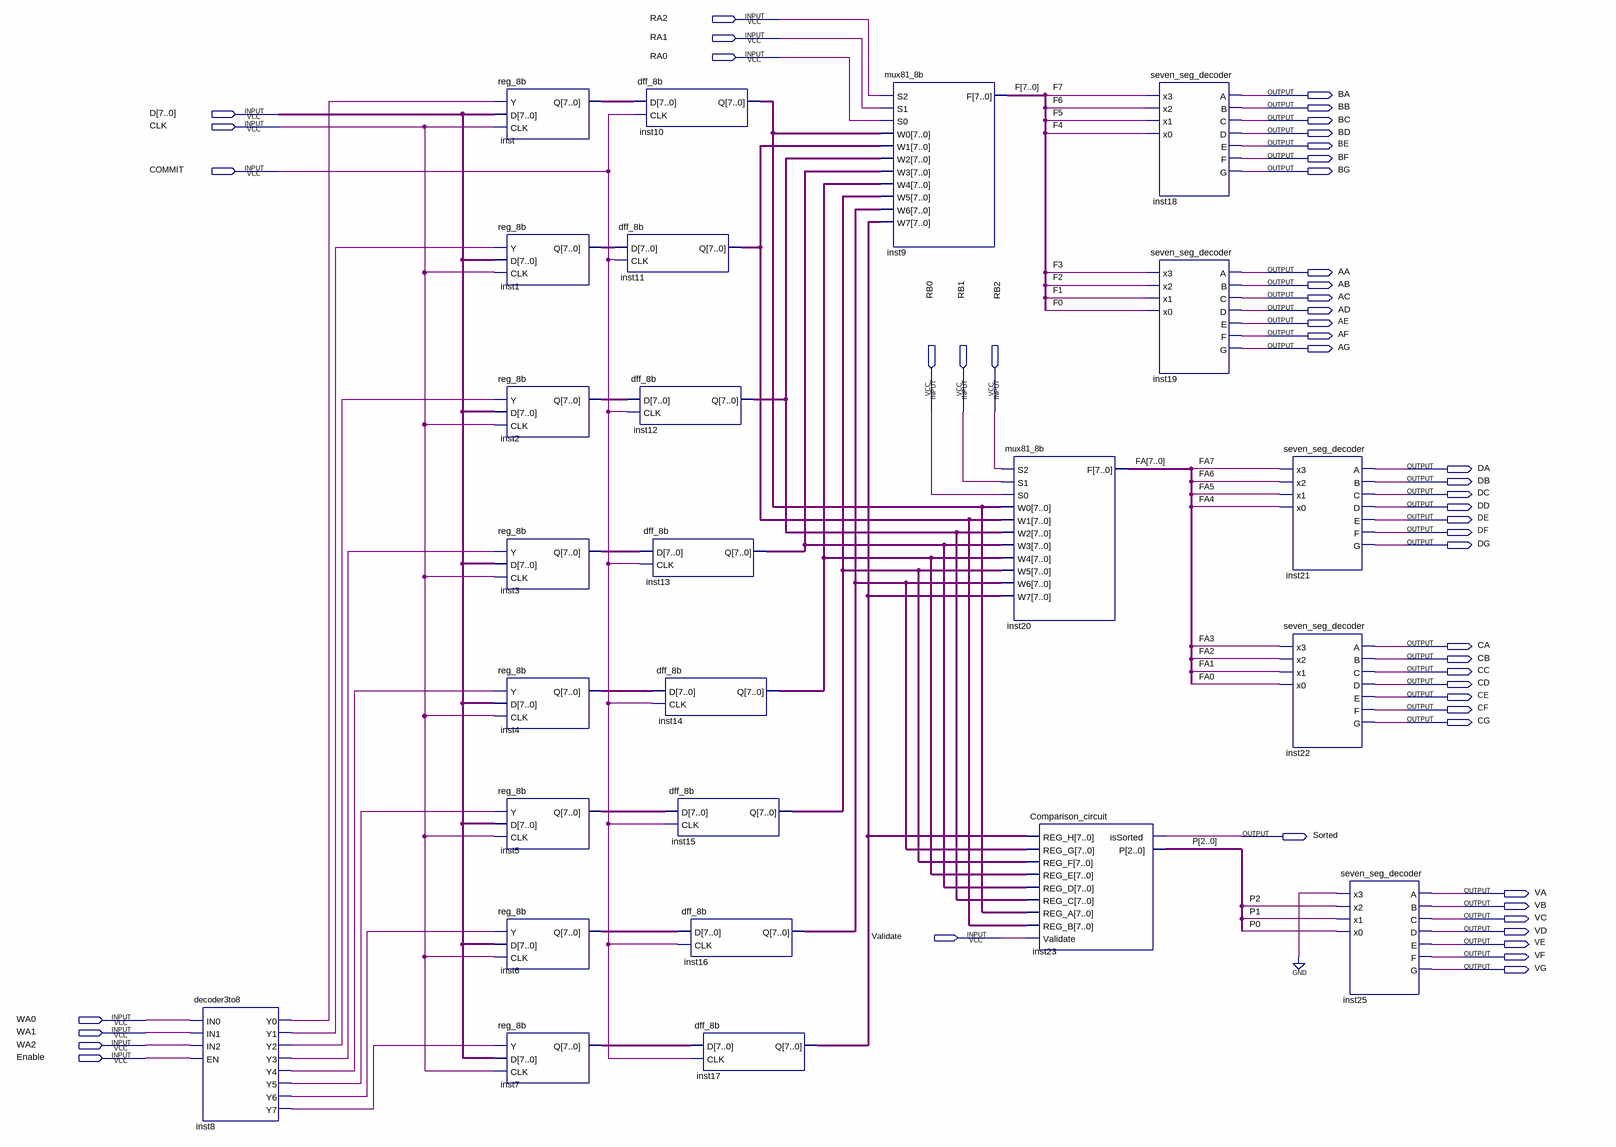
[diagram p0: schematic sheet]
// Quartus schematic Checker.bdf as structural Verilog: 25 symbols, 50 pins
module Checker (
  input  RA2,
  input  RA1,
  input  RA0,
  input  [7:0] D,
  input  CLK,
  input  COMMIT,
  input  RB0,
  input  RB1,
  input  RB2,
  input  Validate,
  input  WA0,
  input  WA1,
  input  WA2,
  input  Enable,
  output BA,
  output BB,
  output BC,
  output BD,
  output BE,
  output BF,
  output BG,
  output AA,
  output AB,
  output AC,
  output AD,
  output AE,
  output AF,
  output AG,
  output DA,
  output DB,
  output DC,
  output DD,
  output DE,
  output DF,
  output DG,
  output CA,
  output CB,
  output CC,
  output CD,
  output CE,
  output CF,
  output CG,
  output Sorted,
  output VA,
  output VB,
  output VC,
  output VD,
  output VE,
  output VF,
  output VG
);

  wire inst8_y0, inst8_y1, inst8_y2, inst8_y3, inst8_y4, inst8_y5, inst8_y6, inst8_y7;
  wire [2:0] P;
  wire [7:0] F, FA, inst1_q, inst2_q, inst3_q, inst4_q, inst5_q, inst6_q, inst7_q, inst10_q, inst11_q,
       inst12_q, inst13_q, inst14_q, inst15_q, inst16_q, inst17_q, inst_q;

  decoder3to8 inst8 (
    .IN0(WA0), .IN1(WA1), .IN2(WA2), .EN(Enable), .Y0(inst8_y0), .Y1(inst8_y1), .Y2(inst8_y2), .Y3(inst8_y3),
    .Y4(inst8_y4), .Y5(inst8_y5), .Y6(inst8_y6), .Y7(inst8_y7));
  reg_8b inst (.Y(inst8_y0), .D(D), .CLK(CLK), .Q(inst_q));
  reg_8b inst1 (.Y(inst8_y1), .D(D), .CLK(CLK), .Q(inst1_q));
  reg_8b inst2 (.Y(inst8_y2), .D(D), .CLK(CLK), .Q(inst2_q));
  reg_8b inst3 (.Y(inst8_y3), .D(D), .CLK(CLK), .Q(inst3_q));
  reg_8b inst4 (.Y(inst8_y4), .D(D), .CLK(CLK), .Q(inst4_q));
  reg_8b inst5 (.Y(inst8_y5), .D(D), .CLK(CLK), .Q(inst5_q));
  reg_8b inst6 (.Y(inst8_y6), .D(D), .CLK(CLK), .Q(inst6_q));
  reg_8b inst7 (.Y(inst8_y7), .D(D), .CLK(CLK), .Q(inst7_q));
  dff_8b inst11 (.D(inst1_q), .CLK(COMMIT), .Q(inst11_q));
  dff_8b inst12 (.D(inst2_q), .CLK(COMMIT), .Q(inst12_q));
  dff_8b inst10 (.D(inst_q), .CLK(COMMIT), .Q(inst10_q));
  dff_8b inst13 (.D(inst3_q), .CLK(COMMIT), .Q(inst13_q));
  dff_8b inst14 (.D(inst4_q), .CLK(COMMIT), .Q(inst14_q));
  dff_8b inst15 (.D(inst5_q), .CLK(COMMIT), .Q(inst15_q));
  dff_8b inst16 (.D(inst6_q), .CLK(COMMIT), .Q(inst16_q));
  dff_8b inst17 (.D(inst7_q), .CLK(COMMIT), .Q(inst17_q));
  mux81_8b inst9 (
    .S2(RA2), .S1(RA1), .S0(RA0), .W0(inst10_q), .W1(inst11_q), .W2(inst12_q), .W3(inst13_q), .W4(inst14_q),
    .W5(inst15_q), .W6(inst16_q), .W7(inst17_q), .F(F));
  mux81_8b inst20 (
    .S2(RB2), .S1(RB1), .S0(RB0), .W0(inst10_q), .W1(inst11_q), .W2(inst12_q), .W3(inst13_q), .W4(inst14_q),
    .W5(inst15_q), .W6(inst16_q), .W7(inst17_q), .F(FA));
  Comparison_circuit inst23 (
    .REG_H(inst17_q), .REG_G(inst16_q), .REG_F(inst15_q), .REG_E(inst14_q), .REG_D(inst13_q),
    .REG_C(inst12_q), .REG_A(inst10_q), .REG_B(inst11_q), .Validate(Validate), .isSorted(Sorted), .P(P));
  seven_seg_decoder inst18 (
    .x3(F[7]), .x2(F[6]), .x1(F[5]), .x0(F[4]), .A(BA), .B(BB), .C(BC), .D(BD), .E(BE), .F(BF), .G(BG));
  seven_seg_decoder inst19 (
    .x3(F[3]), .x2(F[2]), .x1(F[1]), .x0(F[0]), .A(AA), .B(AB), .C(AC), .D(AD), .E(AE), .F(AF), .G(AG));
  seven_seg_decoder inst21 (
    .x3(FA[7]), .x2(FA[6]), .x1(FA[5]), .x0(FA[4]), .A(DA), .B(DB), .C(DC), .D(DD), .E(DE), .F(DF), .G(DG));
  seven_seg_decoder inst22 (
    .x3(FA[3]), .x2(FA[2]), .x1(FA[1]), .x0(FA[0]), .A(CA), .B(CB), .C(CC), .D(CD), .E(CE), .F(CF), .G(CG));
  seven_seg_decoder inst25 (
    .x3(1'b0), .x2(P[2]), .x1(P[1]), .x0(P[0]), .A(VA), .B(VB), .C(VC), .D(VD), .E(VE), .F(VF), .G(VG));
endmodule
